# Altium project 2040.PrjPCB
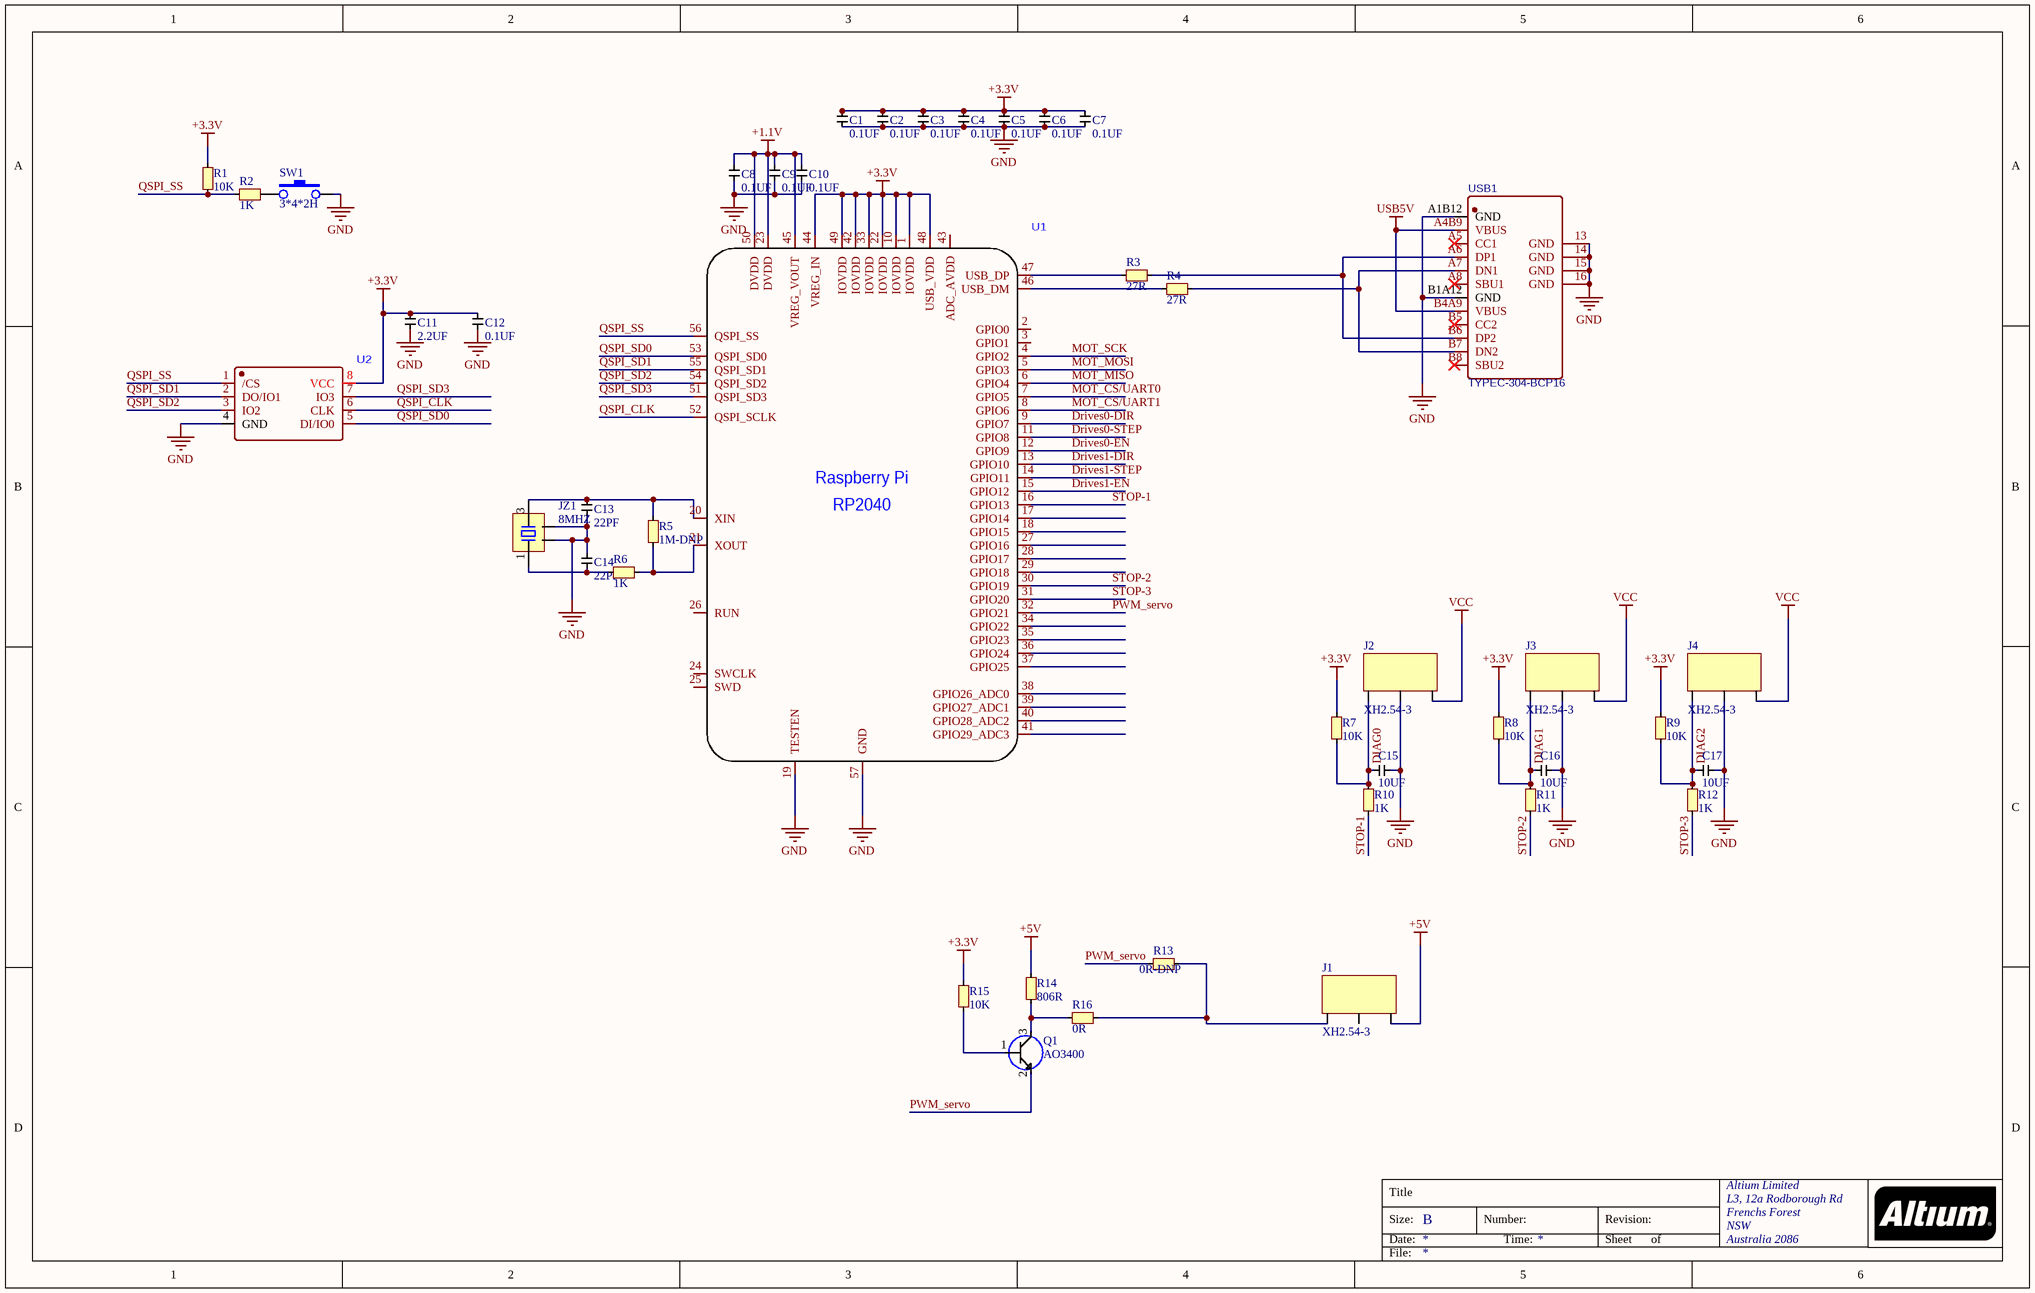
[diagram p0: 2040.SchDoc]
3 sheets, 82 parts. Net scope: global (net labels, ports and power ports of the same name join across sheets).
Board file: 兔子.PcbDoc
Sheets:
  2040.SchDoc
  Drives.SchDoc
  POWER.SchDoc

## Sheet 2040.SchDoc
size B; Organization: Altium Limited; Address1: L3, 12a Rodborough Rd; Address2: Frenchs Forest; Address3: NSW; Address4: Australia 2086

### Parts
C1  0.1UF  [C0402]
C2  0.1UF  [C0402]
C3  0.1UF  [C0402]
C4  0.1UF  [C0402]
C5  0.1UF  [C0402]
C6  0.1UF  [C0402]
C7  0.1UF  [C0402]
C8  0.1UF  [C0402]
C9  0.1UF  [C0402]
C10  0.1UF  [C0402]
C11  2.2UF  [C0402]
C12  0.1UF  [C0402]
C13  22PF  [0603C]
C14  22PF  [0603C]
C15  10UF  [0603C]
C16  10UF  [0603C]
C17  10UF  [0603C]
J1  XH2.54-3  [JST_XH_B3B-XH-A_1X03_P2.50MM_VERTICAL]
J2  XH2.54-3  [JST_XH_B3B-XH-A_1X03_P2.50MM_VERTICAL]
J3  XH2.54-3  [JST_XH_B3B-XH-A_1X03_P2.50MM_VERTICAL]
J4  XH2.54-3  [JST_XH_B3B-XH-A_1X03_P2.50MM_VERTICAL]
JZ1  8MHZ  [OSC-3225-4P]
Q1  AO3400  [SOT-23]
R1  10K  [0603]
R2  1K  [0603]
R3  27R  [R0402]
R4  27R  [R0402]
R5  1M-DNP  [0603]
R6  1K  [0603]
R7  10K  [0603]
R8  10K  [0603]
R9  10K  [0603]
R10  1K  [0603]
R11  1K  [0603]
R12  1K  [0603]
R13  0R-DNP  [0603]
R14  806R  [0603]
R15  10K  [0603]
R16  0R  [0603]
SW1  3*4*2H  [K]
U1  (no value)  [RP2040]
U2  (no value)  [SOP-8]
USB1  TYPEC-304-BCP16  [USB-C-SMD_TYPEC-304-BCP16]

### Nets
+1.1V: C8.1 C9.1 C10.1 U1.23(DVDD) U1.45(VREG_VOUT) U1.50(DVDD)
+3.3V: C1.1 C2.1 C3.1 C4.1 C5.1 C6.1 C7.1 C11.1 C12.1 R1.1 R7.2 R8.2 R9.2 R15.1 U1.1(IOVDD) U1.10(IOVDD) U1.22(IOVDD) U1.33(IOVDD) U1.42(IOVDD) U1.44(VREG_IN) U1.48(USB_VDD) U1.49(IOVDD) U2.8(VCC)
+5V: J1.3 R14.2
GND: C1.2 C2.2 C3.2 C4.2 C5.2 C6.2 C7.2 C8.2 C9.2 C10.2 C11.2 C12.2 C13.2 C14.1 C15.1 C16.1 C17.1 J2.2 J3.2 J4.2 JZ1.2 JZ1.4 SW1.2 U1.19(TESTEN) U1.57(GND) U2.4(GND) USB1.13(GND) USB1.14(GND) USB1.15(GND) USB1.16(GND) USB1.A1B12(GND) USB1.B1A12(GND)
USB5V: USB1.A4B9(VBUS) USB1.B4A9(VBUS)
VCC: J2.3 J3.3 J4.3
DIAG0: C15.2 J2.1 R7.1 R10.2
DIAG1: C16.2 J3.1 R8.1 R11.2
DIAG2: C17.2 J4.1 R9.1 R12.2
Drives0-DIR: U1.9(GPIO7)
Drives0-EN: U1.12(GPIO9)
Drives0-STEP: U1.11(GPIO8)
Drives1-DIR: U1.13(GPIO10)
Drives1-EN: U1.15(GPIO12)
Drives1-STEP: U1.14(GPIO11)
MOT_CS/UART0: U1.7(GPIO5)
MOT_CS/UART1: U1.8(GPIO6)
MOT_MISO: U1.6(GPIO4)
MOT_MOSI: U1.5(GPIO3)
MOT_SCK: U1.4(GPIO2)
PWM_servo: Q1.2 R13.2 U1.32(GPIO21)
QSPI_CLK: U1.52(QSPI_SCLK) U2.6(CLK)
QSPI_SD0: U1.53(QSPI_SD0) U2.5(DI/IO0)
QSPI_SD1: U1.55(QSPI_SD1) U2.2(DO/IO1)
QSPI_SD2: U1.54(QSPI_SD2) U2.3(IO2)
QSPI_SD3: U1.51(QSPI_SD3) U2.7(IO3)
QSPI_SS: R1.2 R2.1 U1.56(QSPI_SS) U2.1(/CS)
STOP-1: R10.1 U1.16(GPIO13)
STOP-2: R11.1 U1.30(GPIO19)
STOP-3: R12.1 U1.31(GPIO20)
NetC13_1: C13.1 JZ1.3 R5.2 U1.20(XIN)
NetC14_2: C14.2 JZ1.1 R6.2
NetJ1_1: J1.1 R13.1 R16.1
NetQ1_1: Q1.1 R15.2
NetQ1_3: Q1.3 R14.1 R16.2
NetR2_2: R2.2 SW1.1
NetR3_1: R3.1 U1.47(USB_DP)
NetR3_2: R3.2 USB1.A6(DP1) USB1.B6(DP2)
NetR4_1: R4.1 U1.46(USB_DM)
NetR4_2: R4.2 USB1.A7(DN1) USB1.B7(DN2)
NetR5_1: R5.1 R6.1 U1.21(XOUT)

Not connected (* = marked no-connect by the designer): J1 2; U1 2(GPIO0) 3(GPIO1) 17(GPIO14) 18(GPIO15) 24(SWCLK) 25(SWD) 26(RUN) 27(GPIO16) 28(GPIO17) 29(GPIO18) 34(GPIO22) 35(GPIO23) 36(GPIO24) 37(GPIO25) 38(GPIO26_ADC0) 39(GPIO27_ADC1) 40(GPIO28_ADC2) 41(GPIO29_ADC3) 43(ADC_AVDD); USB1 A5(CC1)* A8(SBU1)* B5(CC2)* B8(SBU2)*

### Notes on the sheet
- Title
- Size:
- Date:
- B
- Number:
- Time:
- Revision:
- Sheet
- of
- File:
- (in symbol RP2040) Raspberry Pi

### Library data of the parts
C1-C12 = C
C13-C17 = 0603C
JZ1 = JZ3225
Q1 = S8050
R1 R2 R5-R12 = 0603R
R3 R4 R13-R16 = R
SW1 = RESET
U1 = RP2040
U2 = W25Q16JVSSIQ
USB1 = TYPEC-304-BCP16: BOM_Manufacturer: XUNPU; Contributor: LCSC; BOM_Supplier: LCSC; BOM_Supplier Part: C720629; BOM_Manufacturer Part: TYPEC-304-BCP16; spicePre: U; spiceSymbolName: TYPEC-304-BCP16

## Sheet Drives.SchDoc
size B; Organization: Altium Limited; Address1: L3, 12a Rodborough Rd; Address2: Frenchs Forest; Address3: NSW; Address4: Australia 2086
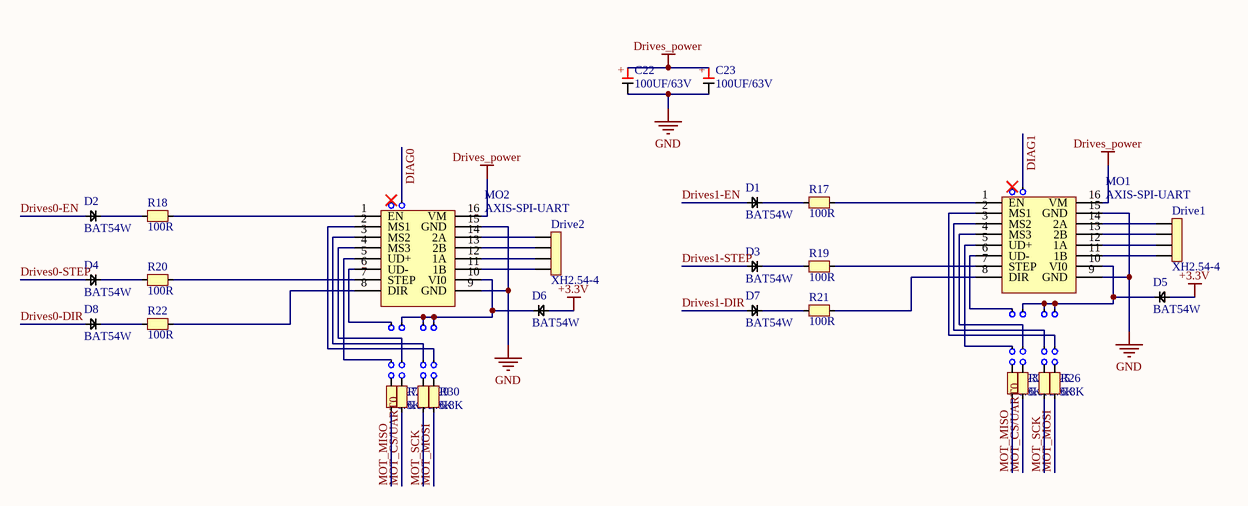
[diagram p1: Drives.SchDoc]

### Parts
C22  100UF/63V  [10*10.5电解电容]
C23  100UF/63V  [10*10.5电解电容]
D1  BAT54W  [SOD-123]
D2  BAT54W  [SOD-123]
D3  BAT54W  [SOD-123]
D4  BAT54W  [SOD-123]
D5  BAT54W  [SOD-123]
D6  BAT54W  [SOD-123]
D7  BAT54W  [SOD-123]
D8  BAT54W  [SOD-123]
Drive1  XH2.54-4  [XH2.54-4]
Drive2  XH2.54-4  [XH2.54-4]
MO1  AXIS-SPI-UART  [AXIS-SPI-UART]
MO2  AXIS-SPI-UART  [AXIS-SPI-UART]
R17  100R  [0603]
R18  100R  [0603]
R19  100R  [0603]
R20  100R  [0603]
R21  100R  [0603]
R22  100R  [0603]
R23  6.8K  [0603]
R24  6.8K  [0603]
R25  6.8K  [0603]
R26  6.8K  [0603]
R27  6.8K  [0603]
R28  6.8K  [0603]
R29  6.8K  [0603]
R30  6.8K  [0603]

### Nets
+3.3V: D5.1 D6.1
Drives_power: C22.1 C23.1 MO1.16(VM) MO2.16(VM)
GND: C22.2 C23.2 MO1.9(GND) MO1.15(GND) MO2.9(GND) MO2.15(GND)
DIAG0: MO2.30
DIAG1: MO1.30
Drives0-DIR: D8.1
Drives0-EN: D2.1
Drives0-STEP: D4.1
Drives1-DIR: D7.1
Drives1-EN: D1.1
Drives1-STEP: D3.1
MOT_CS/UART0: R24.1 R28.1
MOT_MISO: R23.1 R27.1
MOT_MOSI: R26.1 R30.1
MOT_SCK: R25.1 R29.1
NetD1_2: D1.2 R17.2
NetD2_2: D2.2 R18.2
NetD3_2: D3.2 R19.2
NetD4_2: D4.2 R20.2
NetD5_2: D5.2 MO1.10(VI0) MO1.22 MO1.23 MO1.28
NetD6_2: D6.2 MO2.10(VI0) MO2.22 MO2.23 MO2.28
NetD7_2: D7.2 R21.2
NetD8_2: D8.2 R22.2
NetDrive1_1: Drive1.1 MO1.14(2A)
NetDrive1_2: Drive1.2 MO1.13(2B)
NetDrive1_3: Drive1.3 MO1.12(1A)
NetDrive1_4: Drive1.4 MO1.11(1B)
NetDrive2_1: Drive2.1 MO2.14(2A)
NetDrive2_2: Drive2.2 MO2.13(2B)
NetDrive2_3: Drive2.3 MO2.12(1A)
NetDrive2_4: Drive2.4 MO2.11(1B)
NetMO1_1: MO1.1(EN) R17.1
NetMO1_2: MO1.2(MS1) MO1.27
NetMO1_3: MO1.3(MS2) MO1.24
NetMO1_4: MO1.4(MS3) MO1.21
NetMO1_5: MO1.5(UD+) MO1.18
NetMO1_6: MO1.6(UD-) MO1.17
NetMO1_7: MO1.7(STEP) R19.1
NetMO1_8: MO1.8(DIR) R21.1
NetMO1_19: MO1.19 R23.2
NetMO1_20: MO1.20 R24.2
NetMO1_25: MO1.25 R25.2
NetMO1_26: MO1.26 R26.2
NetMO2_1: MO2.1(EN) R18.1
NetMO2_2: MO2.2(MS1) MO2.27
NetMO2_3: MO2.3(MS2) MO2.24
NetMO2_4: MO2.4(MS3) MO2.21
NetMO2_5: MO2.5(UD+) MO2.18
NetMO2_6: MO2.6(UD-) MO2.17
NetMO2_7: MO2.7(STEP) R20.1
NetMO2_8: MO2.8(DIR) R22.1
NetMO2_19: MO2.19 R27.2
NetMO2_20: MO2.20 R28.2
NetMO2_25: MO2.25 R29.2
NetMO2_26: MO2.26 R30.2

Not connected (* = marked no-connect by the designer): MO1 29(3)*; MO2 29(3)*

### Notes on the sheet
- Title
- Size:
- Date:
- B
- Number:
- Time:
- Revision:
- Sheet
- of
- File:
- (in symbol 降压电容) +

### Library data of the parts
C22 C23 = 降压电容
D1-D8 = Diode: BAT46W
R17-R30 = R

## Sheet POWER.SchDoc
size B; Organization: Altium Limited; Address1: L3, 12a Rodborough Rd; Address2: Frenchs Forest; Address3: NSW; Address4: Australia 2086
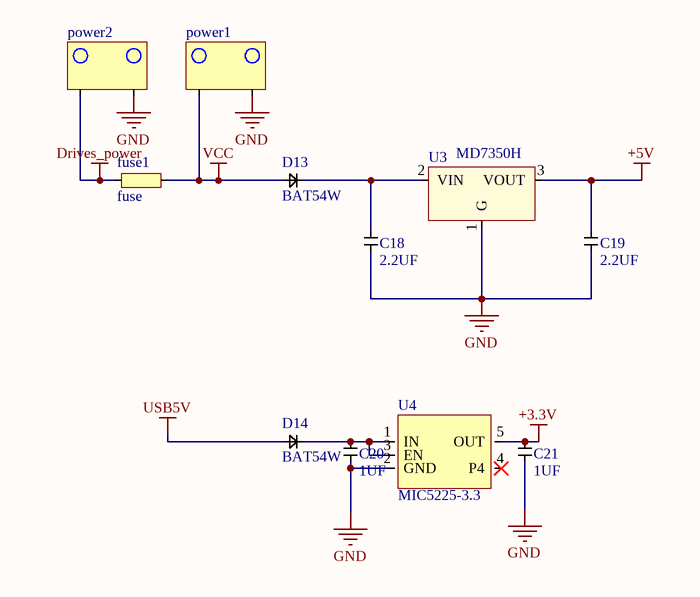
[diagram p2: POWER.SchDoc]

### Parts
C18  2.2UF  [1206]
C19  2.2UF  [1206]
C20  1UF  [0603]
C21  1UF  [0603]
D13  BAT54W  [SOD-123]
D14  BAT54W  [SOD-123]
fuse1  fuse  [保险丝小号]
power1  KF-7.62-2P  [TERMINALBLOCK_BORNIER-2_P5.08MM_2]  (value not drawn)
power2  KF-7.62-2P  [TERMINALBLOCK_BORNIER-2_P5.08MM_2]  (value not drawn)
U3  MD7350H  [SOT-89]
U4  MIC5225-3.3  [SOT23-5]

### Nets
+3.3V: C21.1 U4.5(OUT)
+5V: C19.1 U3.3(VOUT)
Drives_power: fuse1.1 power2.1
GND: C18.2 C19.2 C20.2 C21.2 power1.2 power2.2 U3.1(G) U4.2(GND)
USB5V: D14.1
VCC: D13.1 fuse1.2 power1.1
NetC18_1: C18.1 D13.2 U3.2(VIN)
NetC20_1: C20.1 D14.2 U4.1(IN) U4.3(EN)

Not connected (* = marked no-connect by the designer): U4 4(P4)*

### Notes on the sheet
- Title
- Size:
- Date:
- B
- Number:
- Time:
- Revision:
- Sheet
- of
- File:

### Library data of the parts
C18-C21 = C
D13 D14 = Diode: BAT46W

## Nets that join several sheets
+3.3V: 2040 (23 pins), Drives (D5.1 D6.1), POWER (C21.1 U4.5)
+5V: 2040 (J1.3 R14.2), POWER (C19.1 U3.3)
Drives_power: Drives (C22.1 C23.1 MO1.16 MO2.16), POWER (fuse1.1 power2.1)
GND: 2040 (32 pins), Drives (6 pins), POWER (8 pins)
USB5V: 2040 (USB1.A4B9 USB1.B4A9), POWER (D14.1)
VCC: 2040 (J2.3 J3.3 J4.3), POWER (D13.1 fuse1.2 power1.1)
DIAG0: 2040 (C15.2 J2.1 R7.1 R10.2), Drives (MO2.30)
DIAG1: 2040 (C16.2 J3.1 R8.1 R11.2), Drives (MO1.30)
Drives0-DIR: 2040 (U1.9), Drives (D8.1)
Drives0-EN: 2040 (U1.12), Drives (D2.1)
Drives0-STEP: 2040 (U1.11), Drives (D4.1)
Drives1-DIR: 2040 (U1.13), Drives (D7.1)
Drives1-EN: 2040 (U1.15), Drives (D1.1)
Drives1-STEP: 2040 (U1.14), Drives (D3.1)
MOT_CS/UART0: 2040 (U1.7), Drives (R24.1 R28.1)
MOT_MISO: 2040 (U1.6), Drives (R23.1 R27.1)
MOT_MOSI: 2040 (U1.5), Drives (R26.1 R30.1)
MOT_SCK: 2040 (U1.4), Drives (R25.1 R29.1)